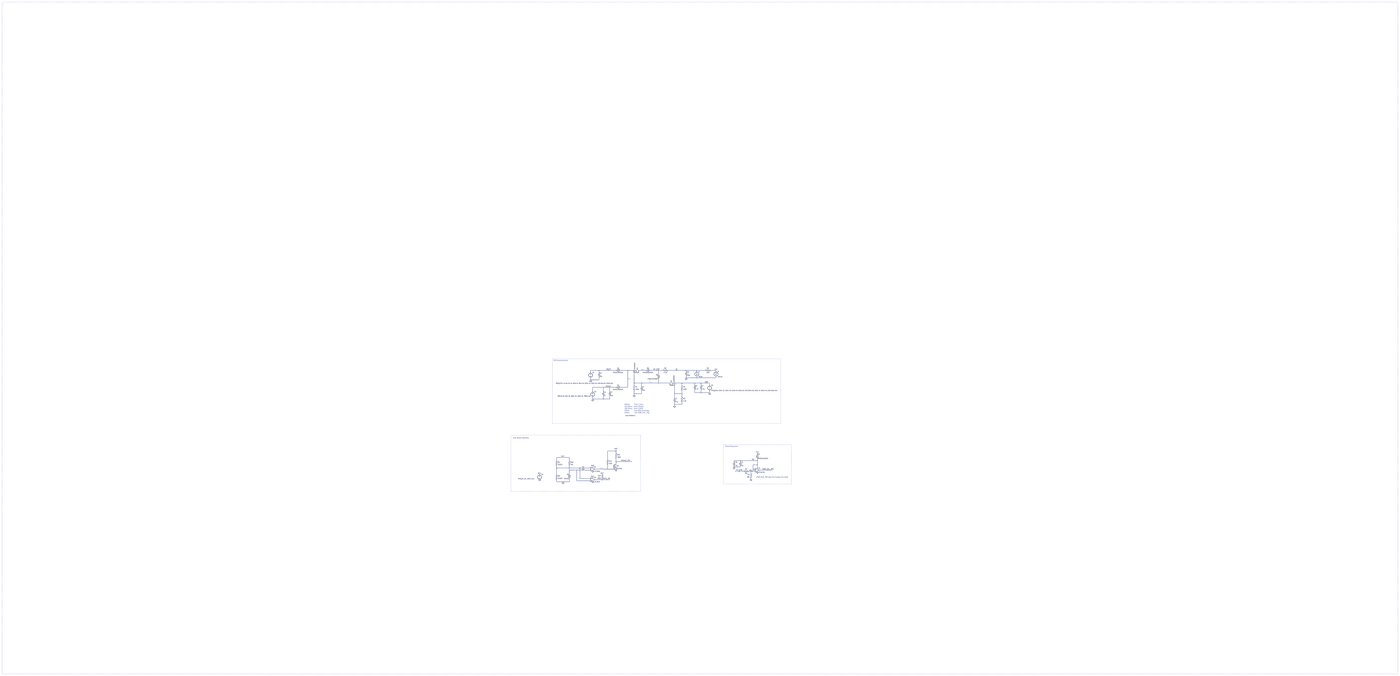
[diagram p0: schematic Power_Switching_Simulation_10-24-15.asc, whole sheet]
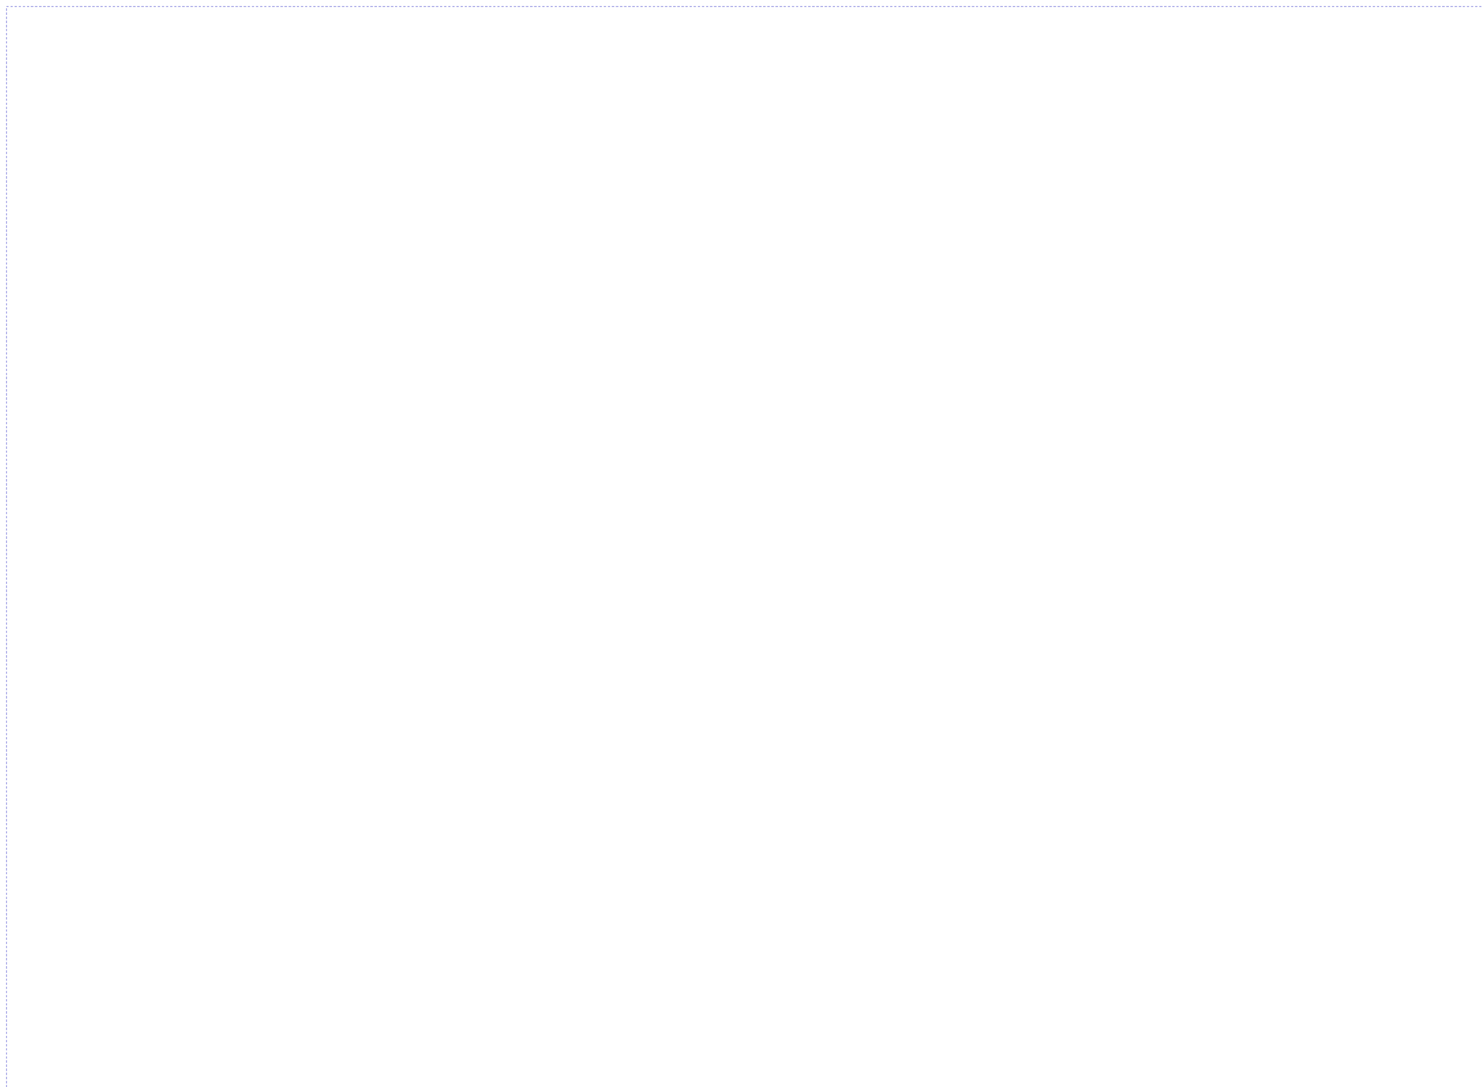
[diagram p1: schematic Power_Switching_Simulation_10-24-15.asc, part, row 1 of 2, column 1 of 3]
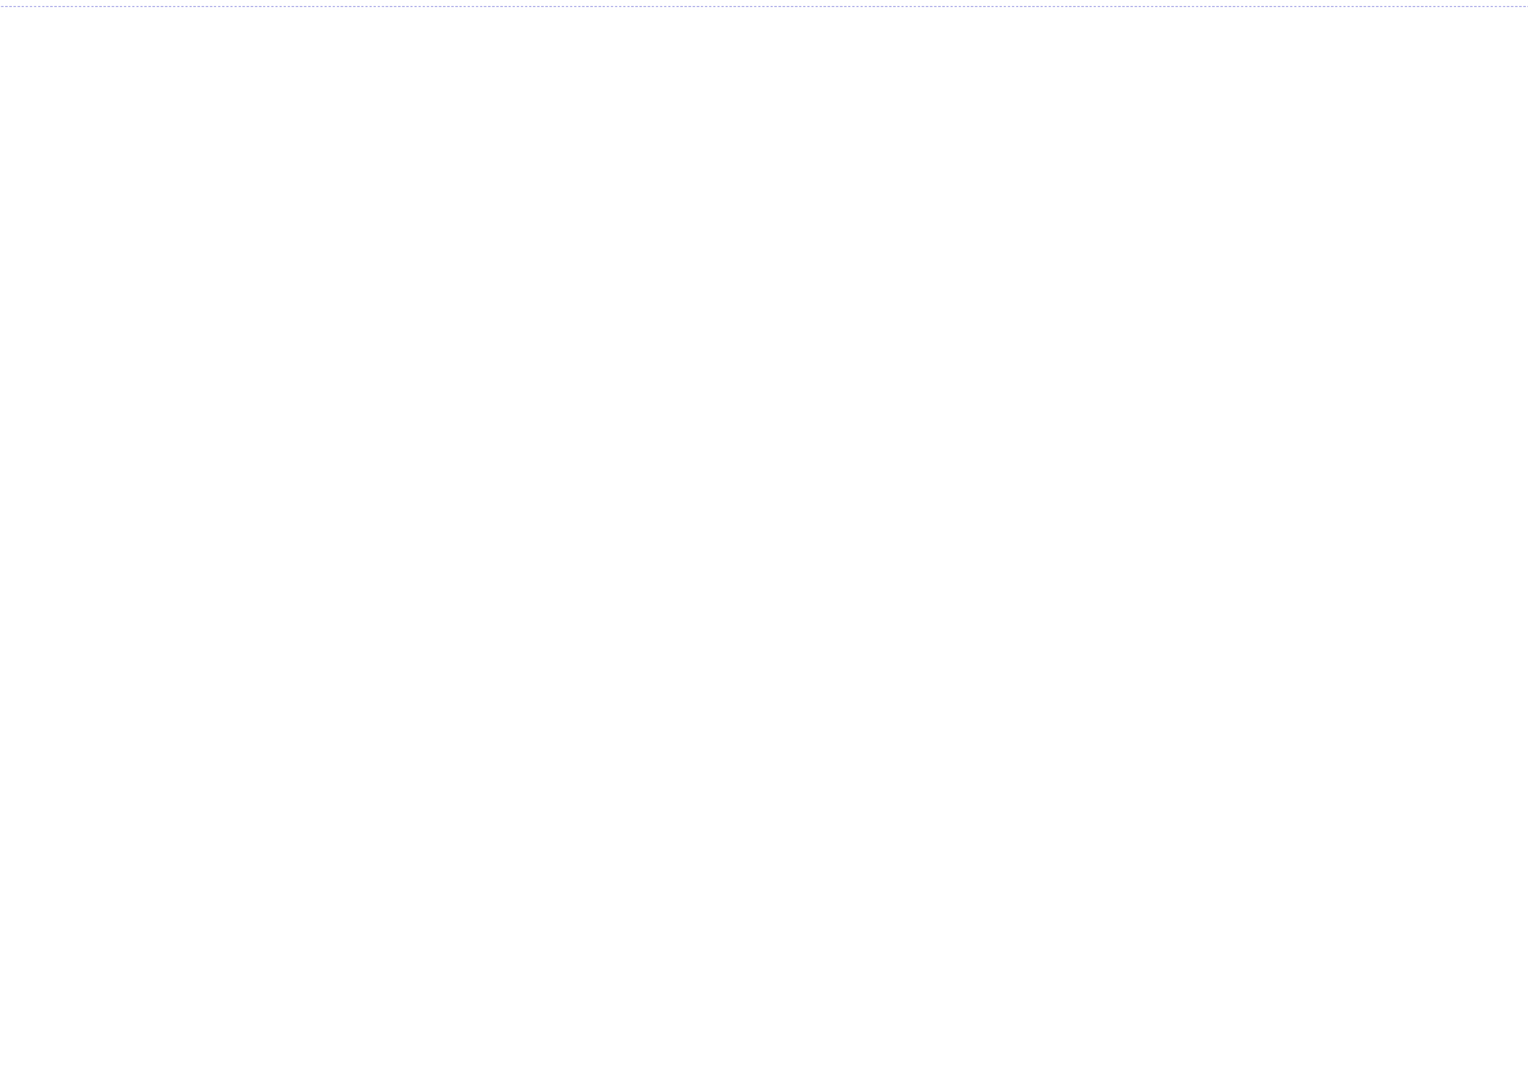
[diagram p2: schematic Power_Switching_Simulation_10-24-15.asc, part, row 1 of 2, column 2 of 3]
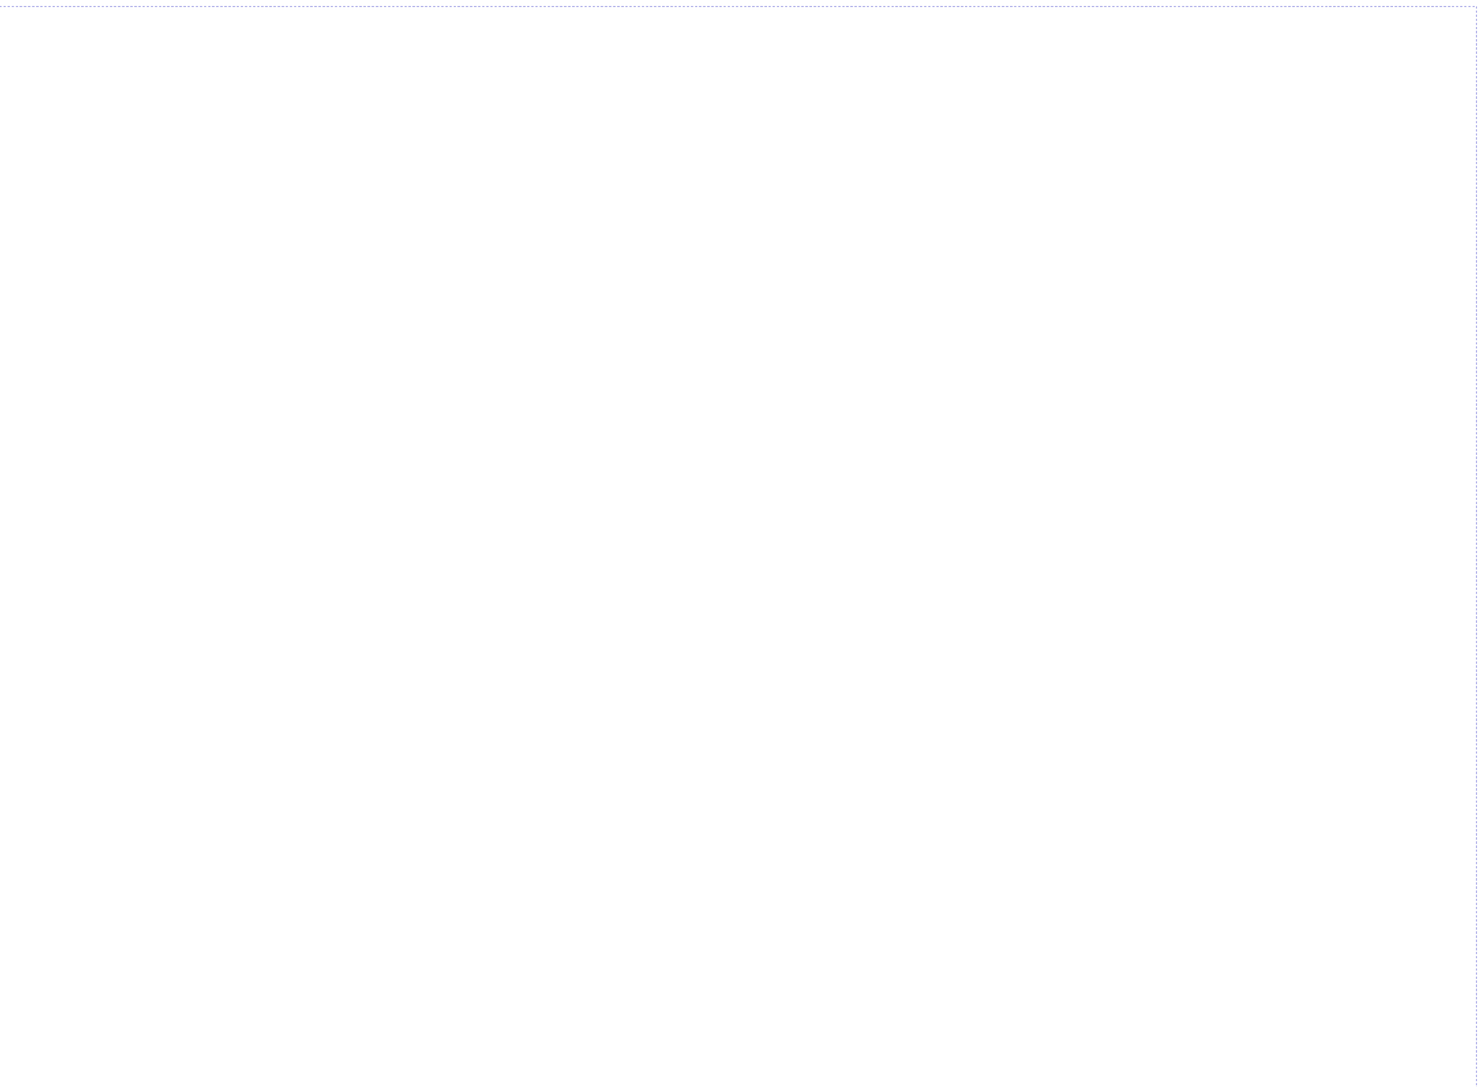
[diagram p3: schematic Power_Switching_Simulation_10-24-15.asc, part, row 1 of 2, column 3 of 3]
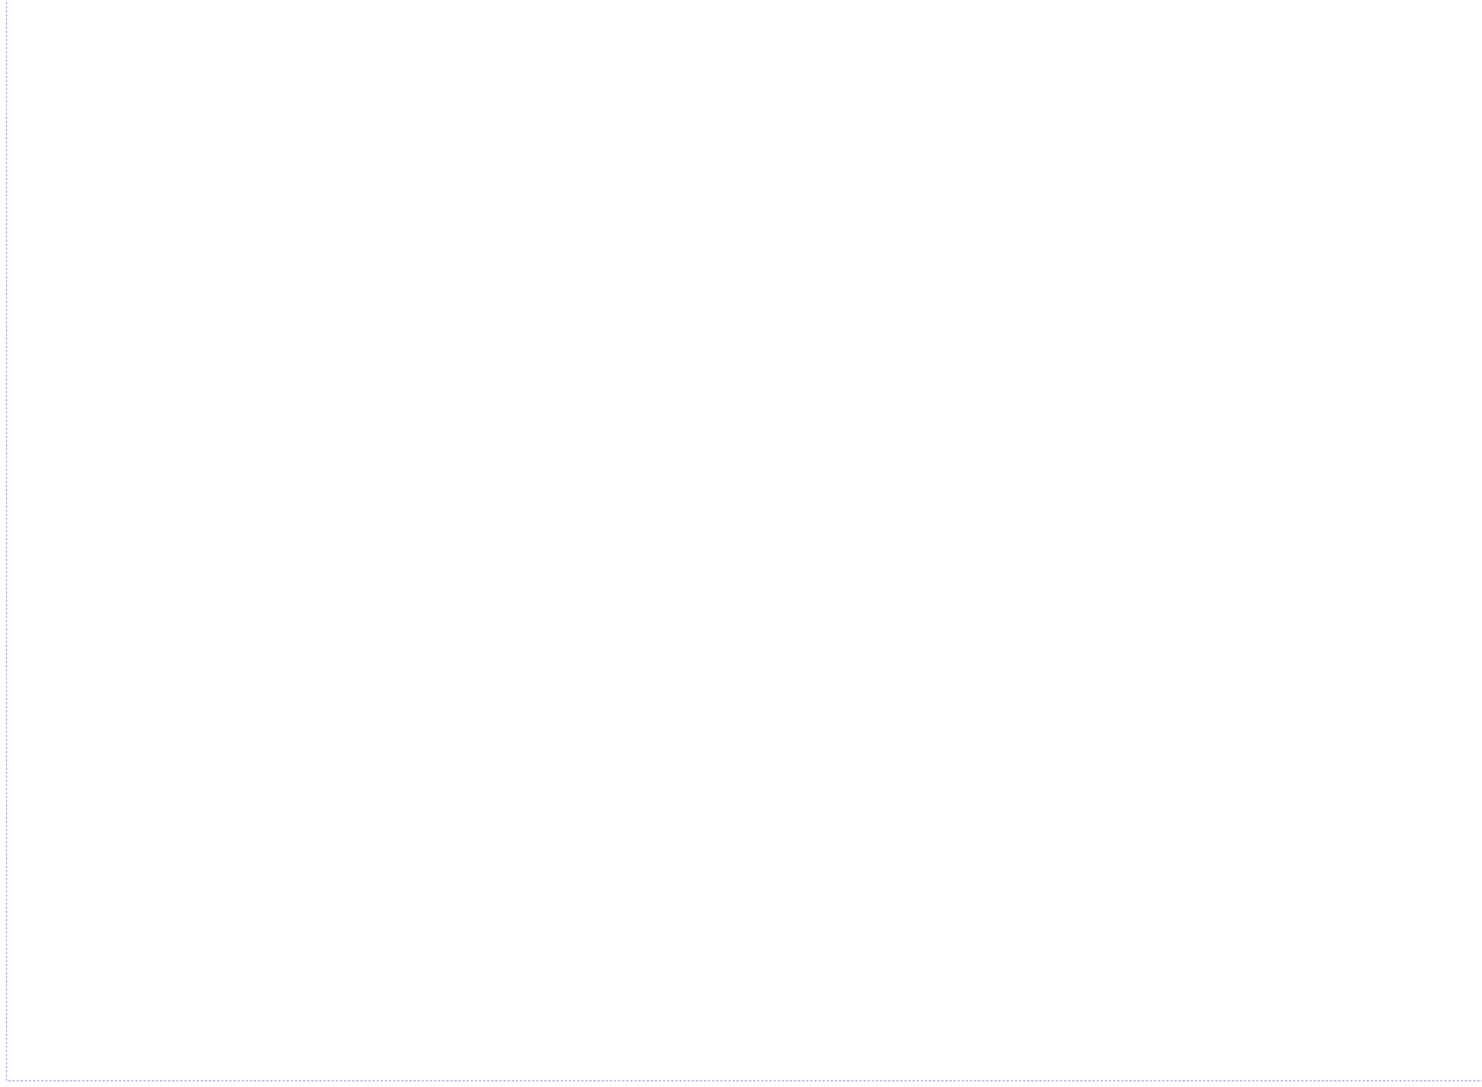
[diagram p4: schematic Power_Switching_Simulation_10-24-15.asc, part, row 2 of 2, column 1 of 3]
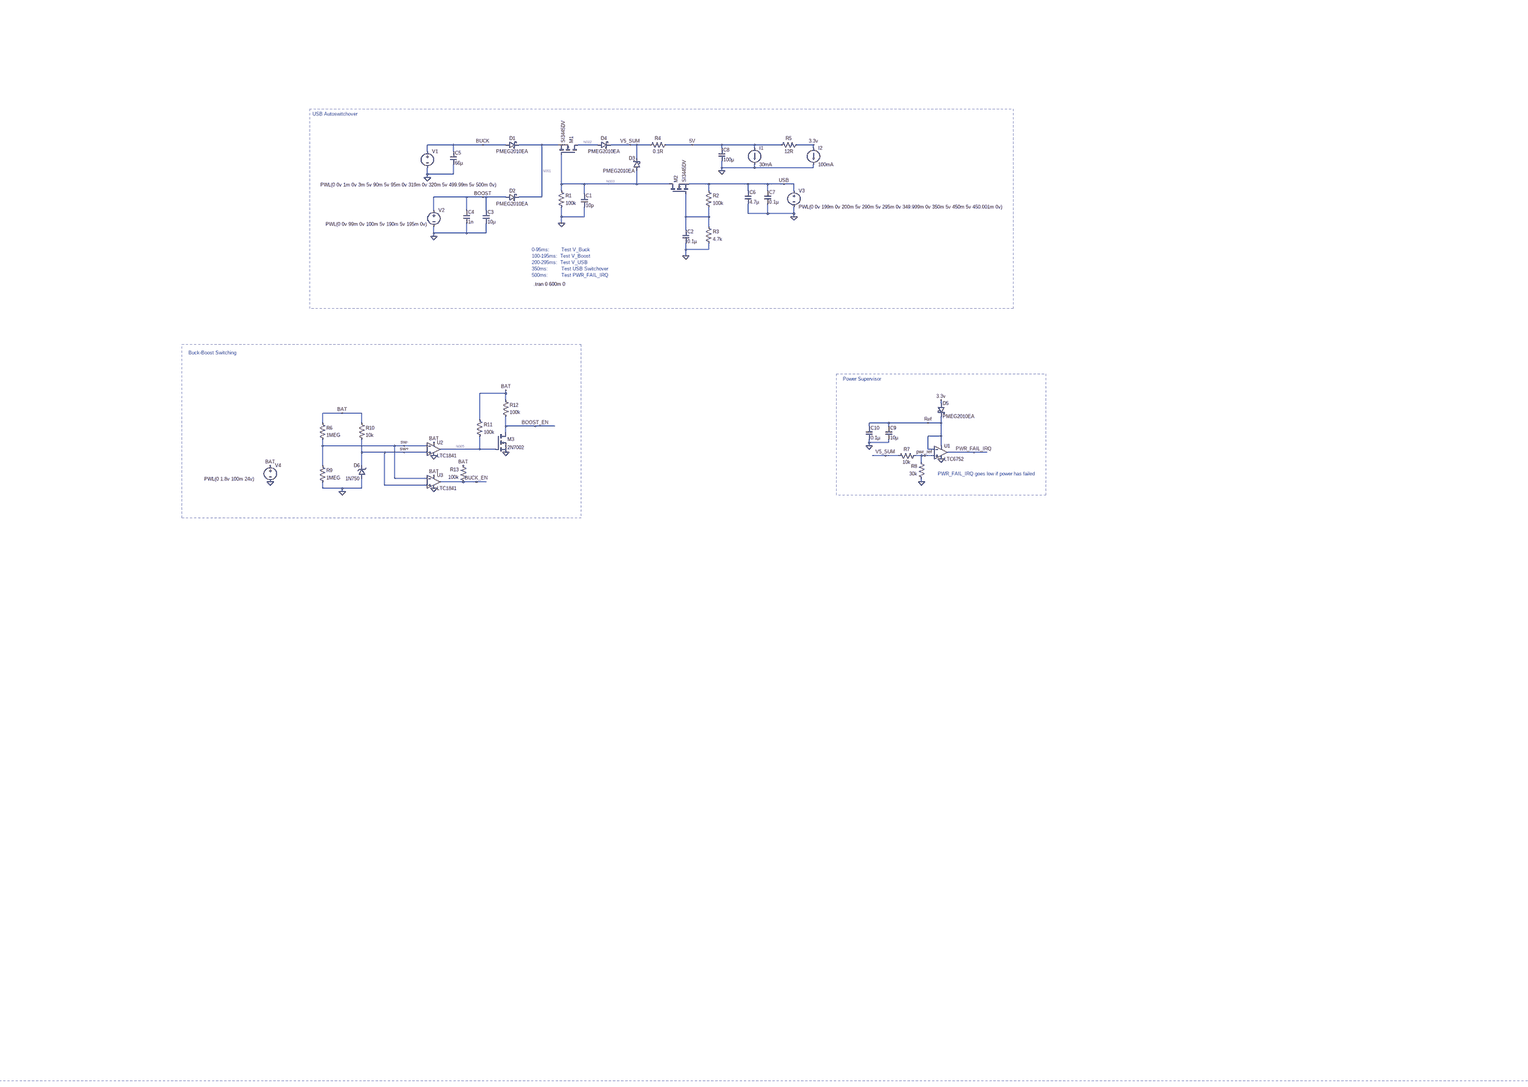
[diagram p5: schematic Power_Switching_Simulation_10-24-15.asc, part, row 2 of 2, column 2 of 3]
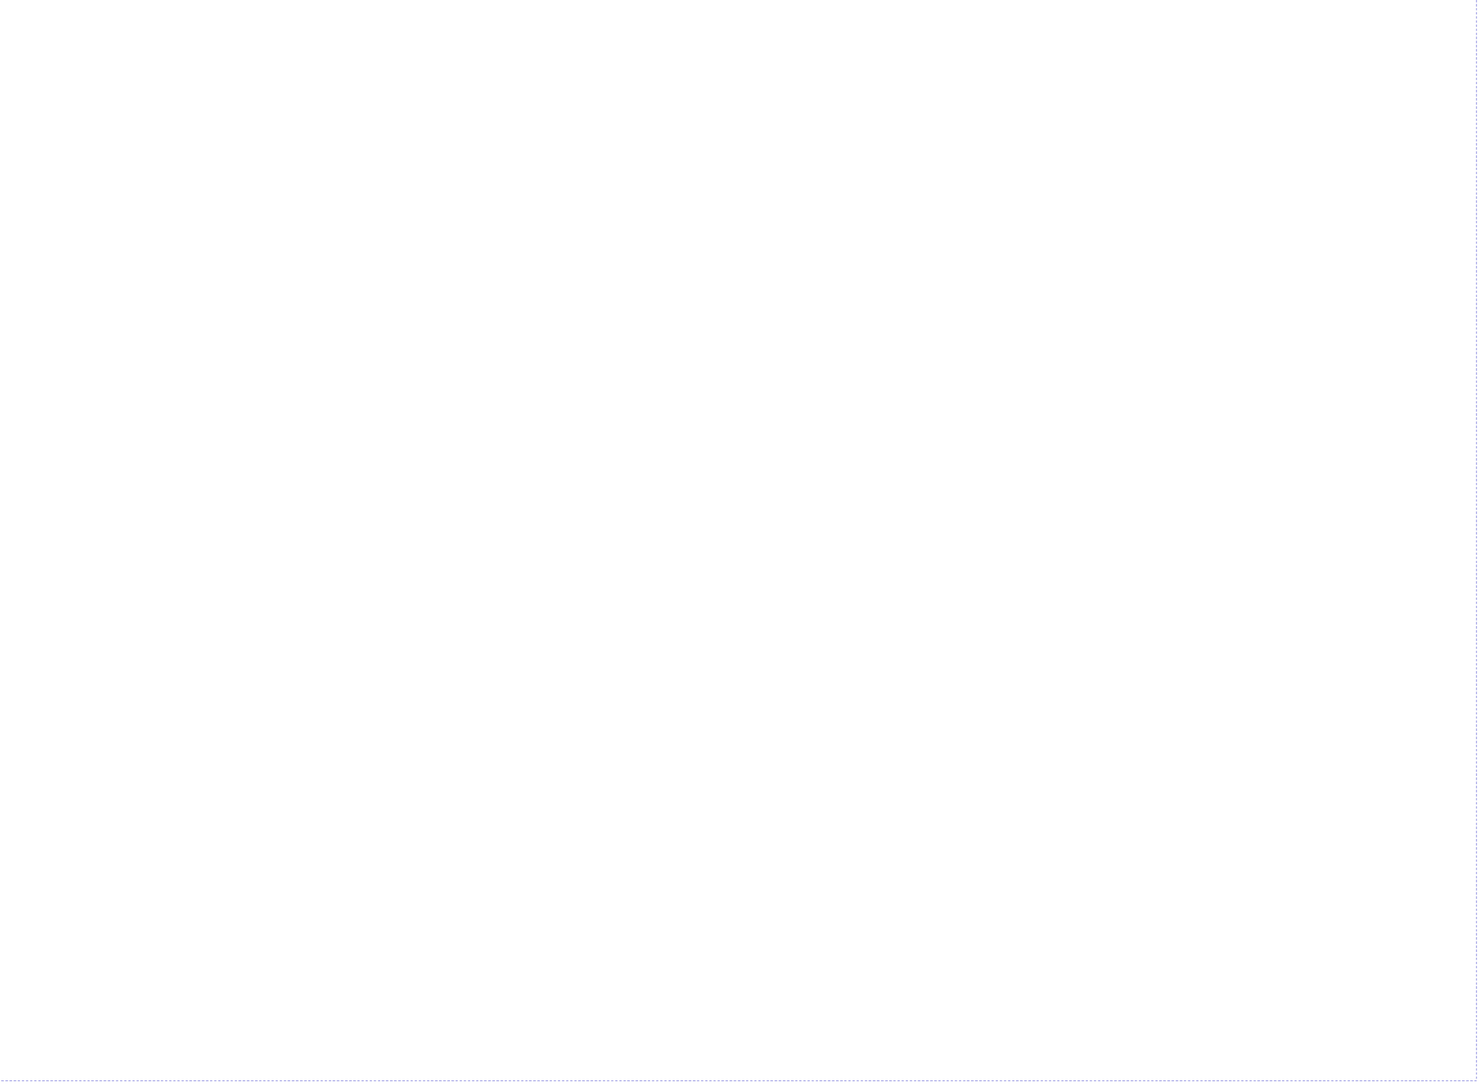
[diagram p6: schematic Power_Switching_Simulation_10-24-15.asc, part, row 2 of 2, column 3 of 3]
* Power_Switching_Simulation_10-24-15.asc
D1 BUCK N001 PMEG2010EA
D2 BOOST N001 PMEG2010EA
M1 N002 N003 N001 N001 SI3445DV
M2 N003 N004 USB USB SI3445DV
R1 N003 0 100k
C1 N003 0 10p
C2 N004 0 0.1µ
R2 USB N004 100k
R3 N004 0 4.7k
D3 N003 V5_SUM PMEG2010EA
D4 N002 V5_SUM PMEG2010EA
R4 5V V5_SUM 0.1R
C3 BOOST 0 10µ
C4 BOOST 0 1n
C5 BUCK 0 66µ
V1 BUCK 0 PWL(0 0v 1m 0v 3m 5v 90m 5v 95m 0v 319m 0v 320m 5v 499.99m 5v 500m 0v)
V2 BOOST 0 PWL(0 0v 99m 0v 100m 5v 190m 5v 195m 0v)
V3 USB 0 PWL(0 0v 199m 0v 200m 5v 290m 5v 295m 0v 349.999m 0v 350m 5v 450m 5v 450.001m 0v)
C6 USB 0 4.7µ
C7 USB 0 0.1µ
C8 5V 0 100µ
I1 5V 0 30mA
XU1 pwr_ref Ref Ref 0 PWR_FAIL_IRQ LTC6752  ; pins In+ In- V+ V- OUT
R5 3.3v 5V 12R
D5 3.3v Ref PMEG2010EA
C9 Ref 0 10µ
C10 Ref 0 0.1µ
R7 pwr_ref V5_SUM 10k
R8 0 pwr_ref 30k
I2 3.3v 0 100mA
* U2: LTC1841 (symbol Comparators\LTC1841 not available, pins judged from their places): In+=sw+ In-=sw- V+=BAT V-=0 OUT=N005
* U3: LTC1841 (symbol Comparators\LTC1841 not available, pins judged from their places): In+=sw+ In-=sw- V+=BAT V-=0 OUT=BUCK_EN
V4 BAT 0 PWL(0 1.8v 100m 24v)
R6 BAT sw- 1MEG
R9 sw- 0 1MEG
R10 BAT sw+ 10k
D6 0 sw+ 1N750
R11 BAT N005 100k
R12 BAT BOOST_EN 100k
M3 BOOST_EN N005 0 0 2N7002
R13 BUCK_EN BAT 100k
.model D D
.lib standard.dio
.model NMOS NMOS
.model PMOS PMOS
.lib standard.mos
* 0-95ms:        Test V_Buck
* 100-195ms:  Test V_Boost
* 200-295ms:  Test V_USB
* 350ms:         Test USB Switchover
* 500ms:         Test PWR_FAIL_IRQ
.tran 0 600m 0
* USB Autoswitchover
* Power Supervisor
* PWR_FAIL_IRQ goes low if power has failed
* Buck-Boost Switching
.lib LTC7.lib
.backanno
.end

* Results of the author's LTspice run, read from the files saved beside the schematic
* Operating Point, zero values left out:
*   V(n001) = -285.3 mV
*   V(n002) = -1.001 V
*   V(n003) = -1.256 V
*   V(v5_sum) = -1.312 V
*   V(5v) = -1.325 V
*   V(ref) = -16.48 mV
*   V(pwr_ref) = -709.8 mV
*   V(pwr_fail_irq) = -8.238 mV
*   V(3.3v) = -2.525 V
*   V(n005) = 805.3 µV
*   V(bat) = 1.8 V
*   V(sw+) = 1.789 V
*   V(sw-) = 900 mV
*   V(buck_en) = 805.3 µV
*   V(boost_en) = 1.8 V
*   Id(M3) = 1.838 pA
*   Is(M3) = -1.838 pA
*   Id(M2) = -46.26 pA
*   Is(M2) = 46.26 pA
*   Id(M1) = -129.9 mA
*   Is(M1) = 129.9 mA
*   I(D6) = -1.074 µA
*   I(D5) = -1.686 µA
*   I(D4) = 129.9 mA
*   I(D3) = 12.56 µA
*   I(D2) = 64.96 mA
*   I(D1) = 64.96 mA
*   I(I2) = 100 mA
*   I(I1) = 30 mA
*   I(R13) = -17.99 µA
*   I(R12) = 3.638 pA
*   I(R11) = 17.99 µA
*   I(R10) = 1.074 µA
*   I(R9) = 900 nA
*   I(R6) = 900 nA
*   I(R8) = 23.66 µA
*   I(R7) = 60.25 µA
*   I(R5) = -100 mA
*   I(R4) = -130 mA
*   I(R1) = -12.56 µA
*   I(V4) = -41.47 µA
*   I(V3) = -47.51 pA
*   I(V2) = -64.96 mA
*   I(V1) = -64.96 mA
*   Ix(u1:1) = -36.59 µA
*   Ix(u1:2) = 800 nA
*   Ix(u1:3) = -2.486 µA
*   Ix(u1:4) = 38.28 µA
*   Ix(u2:3) = 1.756 µA
*   Ix(u2:4) = -19.75 µA
*   Ix(u2:5) = 17.99 µA
*   Ix(u3:3) = 1.756 µA
*   Ix(u3:4) = -19.75 µA
*   Ix(u3:5) = 17.99 µA
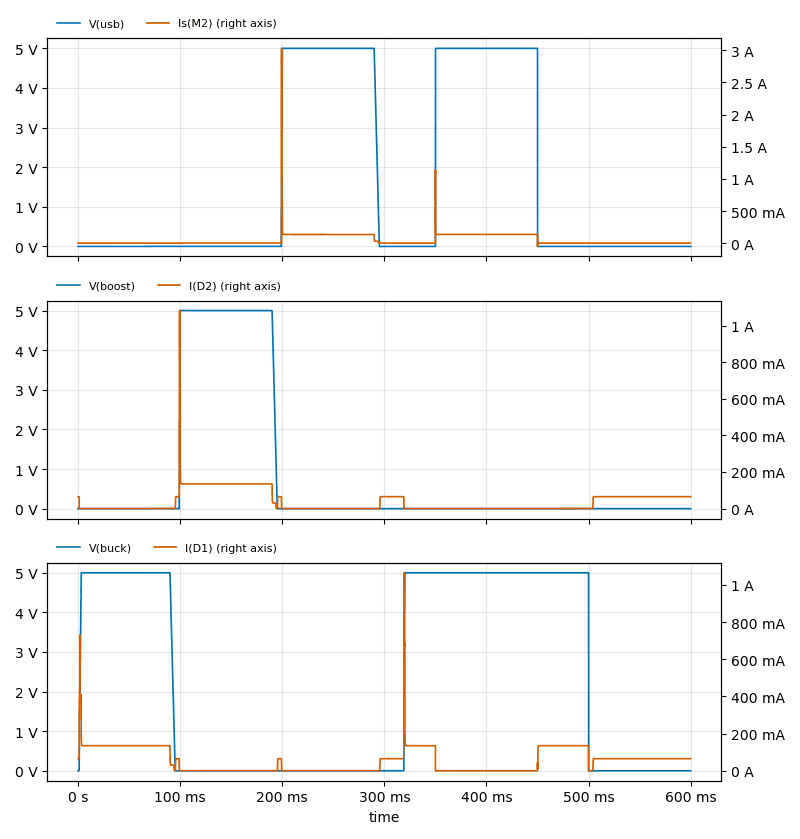
[diagram p7: Transient Analysis of Power_Switching_Simulation_10-24-15.asc, plotted from the saved traces]
* Transient Analysis, 1 run:
*   V(usb): min 0 V, max 5 V, average 1.608 V, rms 2.828 V, last 0 V
*   Is(M2): min -51.24 mA, max 3.031 A, average 44.23 mA, rms 85.25 mA, last 0 A
*   V(boost): min 0 V, max 5 V, average 775 mV, rms 1.958 V, last 0 V
*   I(D2): min -92.24 µA, max 1.082 A, average 35.44 mA, rms 66.94 mA, last 64.96 mA
*   V(buck): min 0 V, max 5 V, average 2.258 V, rms 3.352 V, last 0 V
*   I(D1): min -434.5 µA, max 1.065 A, average 54.11 mA, rms 86.21 mA, last 64.96 mA